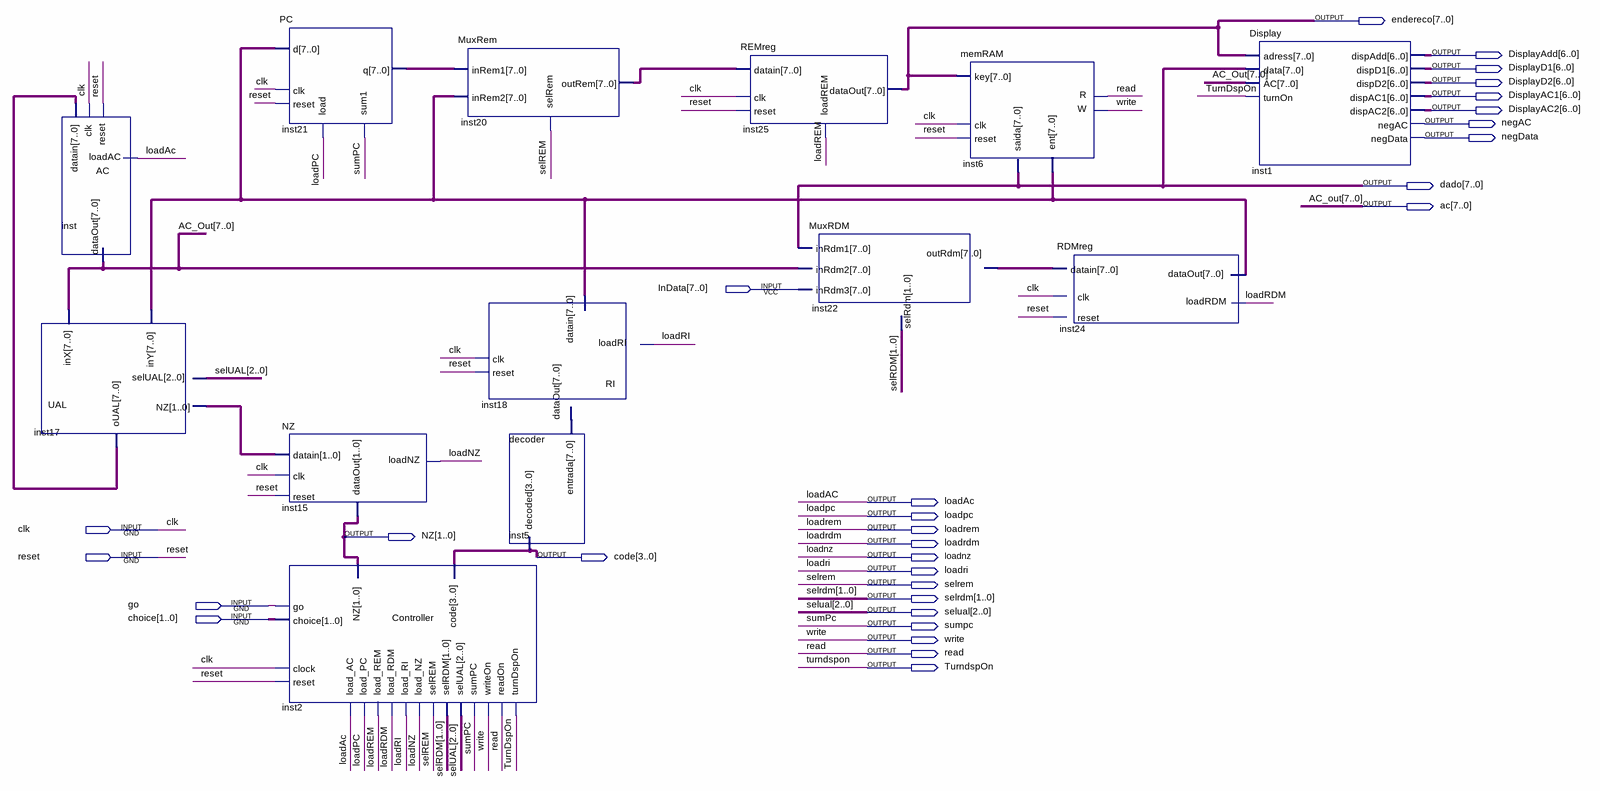
[diagram p0: schematic sheet]
// Quartus schematic NEANDER.bdf as structural Verilog: 13 symbols, 30 pins
module NEANDER (
  input  [7:0] InData,
  input  clk,
  input  reset,
  input  go,
  input  [1:0] choice,
  output [7:0] endereco,
  output [6:0] DisplayAdd,
  output [6:0] DisplayD1,
  output [6:0] DisplayD2,
  output [6:0] DisplayAC1,
  output [6:0] DisplayAC2,
  output negAC,
  output negData,
  output [7:0] dado,
  output [7:0] ac,
  output loadAc,
  output loadpc,
  output loadrem,
  output [1:0] NZ,
  output loadrdm,
  output [3:0] code,
  output loadnz,
  output loadri,
  output selrem,
  output [1:0] selrdm,
  output [2:0] selual,
  output sumpc,
  output write,
  output read,
  output TurndspOn
);

  wire [1:0] inst17_nz;
  wire [7:0] inst17_oual, inst18_dataout, inst20_outrem, inst21_q, inst22_outrdm, inst24_dataout;

  AC inst (.clk(clk), .reset(reset), .loadAC(loadAc), .datain(inst17_oual), .dataOut(ac));
  UAL inst17 (.inX(ac), .inY(inst24_dataout), .selUAL(selual), .oUAL(inst17_oual), .NZ(inst17_nz));
  PC inst21 (.clk(clk), .reset(reset), .load(loadpc), .sum1(sumpc), .d(inst24_dataout), .q(inst21_q));
  NZ inst15 (.clk(clk), .reset(reset), .loadNZ(loadnz), .datain(inst17_nz), .dataOut(NZ));
  Controller inst2 (
    .reset(reset), .clock(clk), .go(go), .NZ(NZ), .code(code), .choice(choice), .load_AC(loadAc),
    .load_PC(loadpc), .load_REM(loadrem), .load_RDM(loadrdm), .load_RI(loadri), .load_NZ(loadnz),
    .selREM(selrem), .selRDM(selrdm), .selUAL(selual), .sumPC(sumpc), .writeOn(write), .readOn(read),
    .turnDspOn(TurndspOn));
  MuxRem inst20 (.selRem(selrem), .inRem1(inst21_q), .inRem2(inst24_dataout), .outRem(inst20_outrem));
  RI inst18 (.clk(clk), .reset(reset), .loadRI(loadri), .datain(inst24_dataout), .dataOut(inst18_dataout));
  decoder inst5 (.entrada(inst18_dataout), .decoded(code));
  REMreg inst25 (.clk(clk), .reset(reset), .loadREM(loadrem), .datain(inst20_outrem), .dataOut(endereco));
  MuxRDM inst22 (.selRdm(selrdm), .inRdm1(dado), .inRdm2(ac), .inRdm3(InData), .outRdm(inst22_outrdm));
  memRAM inst6 (.ent(inst24_dataout), .key(endereco), .R(read), .W(write), .reset(reset), .clk(clk), .saida(dado));
  RDMreg inst24 (.clk(clk), .reset(reset), .loadRDM(loadrdm), .datain(inst22_outrdm), .dataOut(inst24_dataout));
  Display inst1 (
    .adress(endereco), .data(dado), .AC(ac), .turnOn(TurndspOn), .dispAdd(DisplayAdd), .dispD1(DisplayD1),
    .dispD2(DisplayD2), .dispAC1(DisplayAC1), .dispAC2(DisplayAC2), .negAC(negAC), .negData(negData));

  // Other names for the same wires on the sheet: AC_out[7:0] = ac
endmodule
